# EAGLE design test (EAGLE 7.6.0)
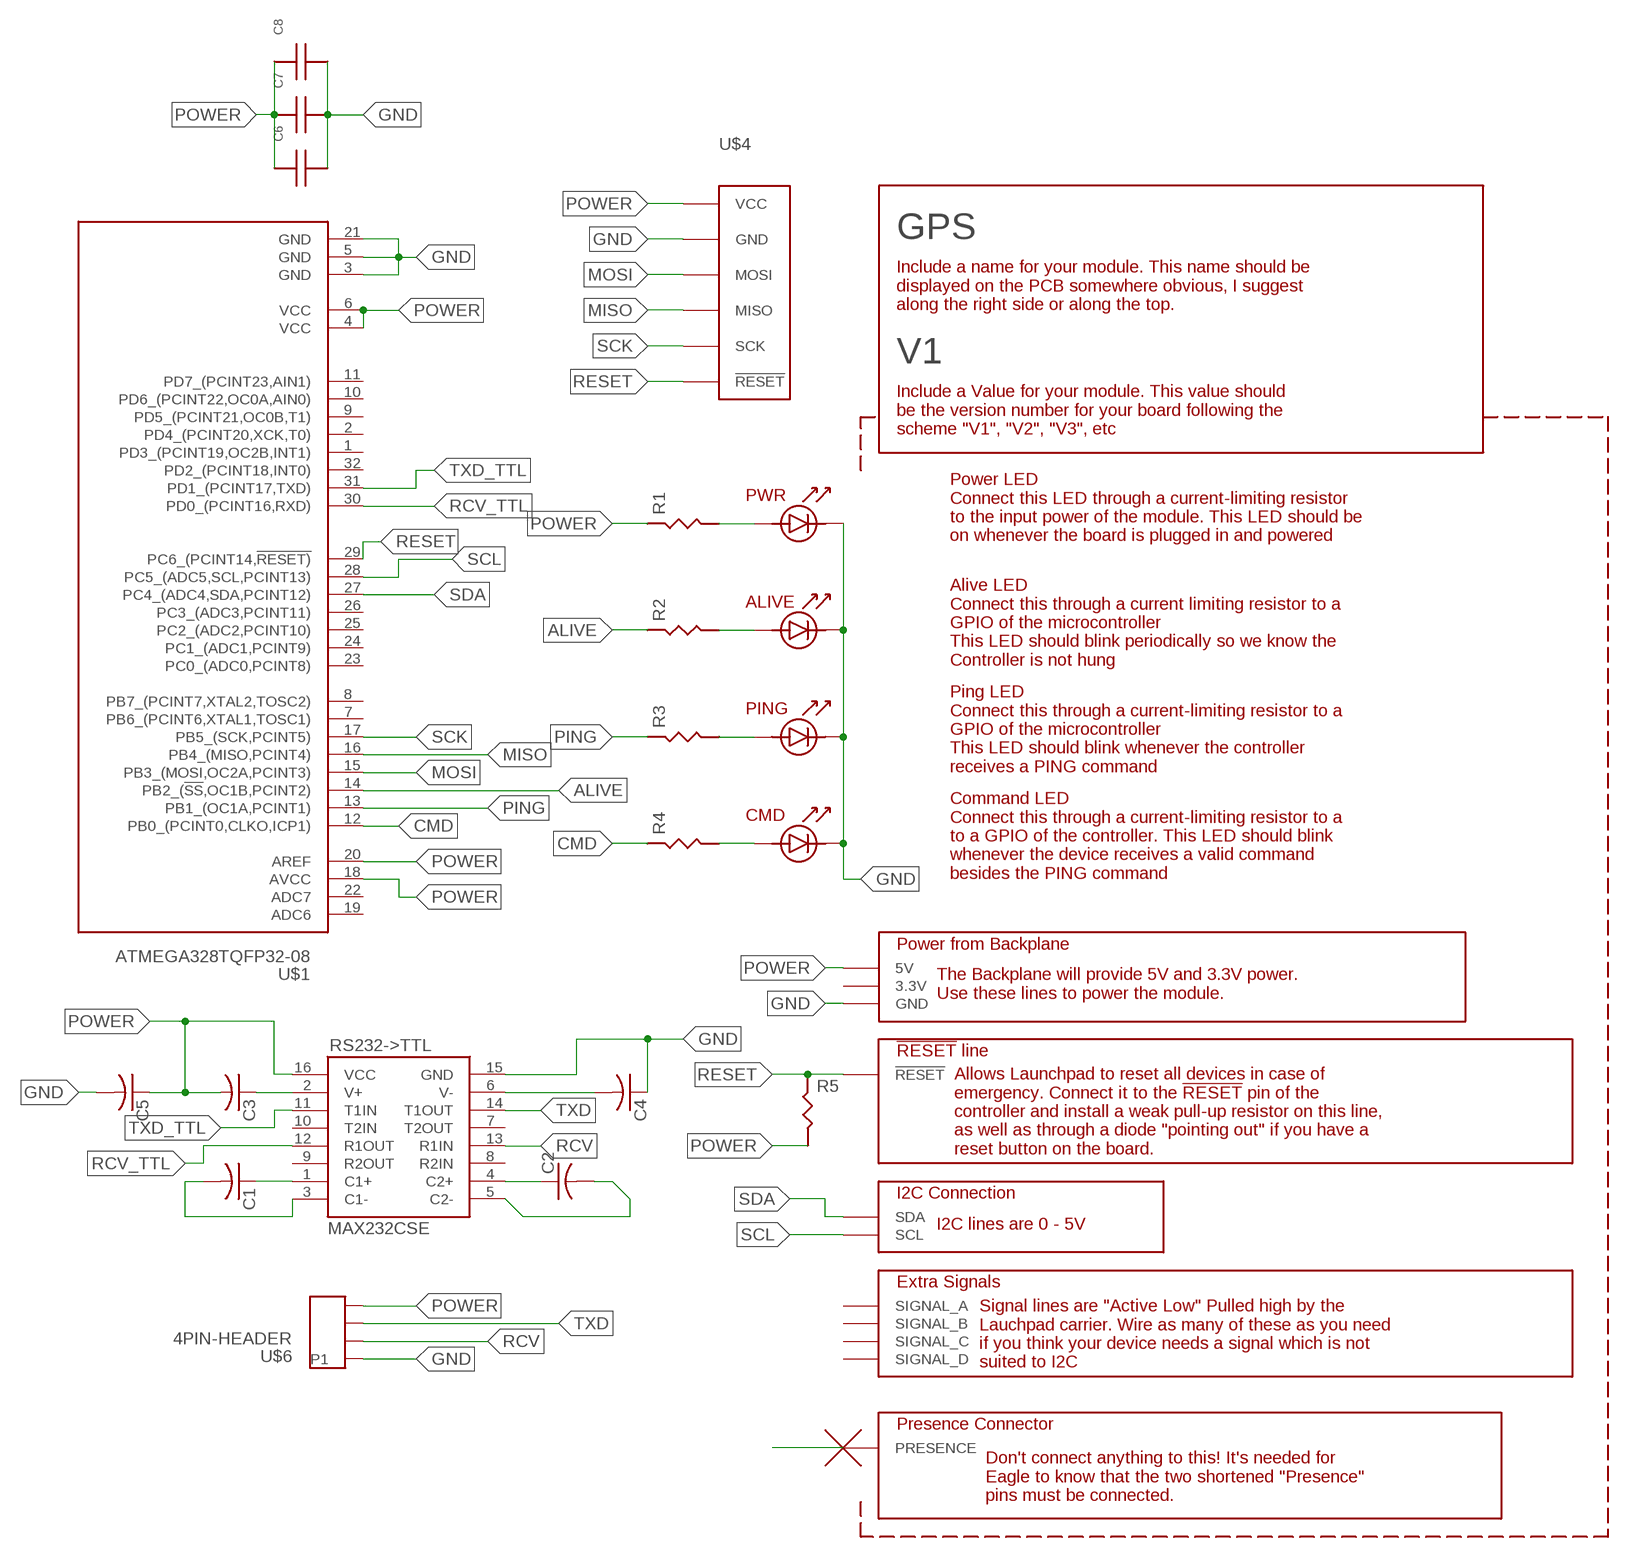
[diagram p0: schematic, sheet 1]

## Parts
C1  C-USC0805  [C0805]
C2  C-USC0805  [C0805]
C3  C-USC0805  [C0805]
C4  C-USC0805  [C0805]
C5  C-USC0805  [C0805]
C6  CAPACITOR-UNPOLARIZED0805  [0805_STACKPOLERESISTOR]
C7  CAPACITOR-UNPOLARIZED0805  [0805_STACKPOLERESISTOR]
C8  CAPACITOR-UNPOLARIZED0805  [0805_STACKPOLERESISTOR]
GPS  V1  EMBEDDED_SUBSYSTEM_V2SMALL  [SUBSYSTEM2016_V2-SMALL]
R1  RESISTOR  [0805_STACKPOLERESISTOR]
R2  RESISTOR  [0805_STACKPOLERESISTOR]
R3  RESISTOR  [0805_STACKPOLERESISTOR]
R4  RESISTOR  [0805_STACKPOLERESISTOR]
R5  RESISTOR  [0805_STACKPOLERESISTOR]
RS232->TTL  MAX232CSE  [MAX232CSE]
U$1  ATMEGA328TQFP32-08  [TQFP32-08]
U$4  ISP_PROGRAMMING_HEADER  [6PINHEADER_CORRECT]
U$6  4PIN-HEADER  [4HEADER_10MIL]

## Nets
ALIVE: R2.P$1 U$1.14(PB2_(!SS,OC1B,PCINT2))
CMD: R4.P$1 U$1.12(PB0_(PCINT0,CLKO,ICP1))
GND: C4.1 C5.2 C6.P$2 C7.P$2 C8.P$2 GPS.A7(GND) GPS.A8(GND) GPS.A9(GND) GPS.A10(GND) GPS.ALIVELED_CATHODE GPS.CMDLED_CATHODE GPS.PINGLED_CATHODE GPS.PWRLED_CATHODE RS232->TTL.15(GND) U$1.3(GND) U$1.5(GND) U$1.21(GND) U$4.6(GND) U$6.P$1(P1)
MISO: U$1.16(PB4_(MISO,PCINT4)) U$4.1(MISO)
MOSI: U$1.15(PB3_(MOSI,OC2A,PCINT3)) U$4.4(MOSI)
N$1: GPS.A2(PRESENCE) GPS.B17(PRESENCE)
N$2: C1.1 RS232->TTL.1(C1+)
N$3: C1.2 RS232->TTL.3(C1-)
N$4: C2.1 RS232->TTL.4(C2+)
N$5: C2.2 RS232->TTL.5(C2-)
N$6: C3.1 RS232->TTL.2(V+)
N$7: GPS.CMDLED_ANODE R4.P$2
N$8: GPS.PWRLED_ANODE R1.P$2
N$9: GPS.ALIVELED_ANODE R2.P$2
N$10: GPS.PINGLED_ANODE R3.P$2
PING: R3.P$1 U$1.13(PB1_(OC1A,PCINT1))
POWER: C3.2 C5.1 C6.P$1 C7.P$1 C8.P$1 GPS.B2(5V) GPS.B3(5V) R1.P$1 R5.P$2 RS232->TTL.16(VCC) U$1.4(VCC) U$1.6(VCC) U$1.18(AVCC) U$1.20(AREF) U$4.2(VCC) U$6.P$4
RCV: RS232->TTL.13(R1IN) U$6.P$2
RCV_TTL: RS232->TTL.12(R1OUT) U$1.30(PD0_(PCINT16,RXD))
RESET: GPS.B5(!RESET) GPS.B6(!RESET) R5.P$1 U$1.29(PC6_(PCINT14,!RESET)) U$4.5(!RESET)
SCK: U$1.17(PB5_(SCK,PCINT5)) U$4.3(SCK)
SCL: GPS.B9(SCL) GPS.B10(SCL) U$1.28(PC5_(ADC5,SCL,PCINT13))
SDA: GPS.B7(SDA) GPS.B8(SDA) U$1.27(PC4_(ADC4,SDA,PCINT12))
TXD: RS232->TTL.14(T1OUT) U$6.P$3
TXD_TTL: RS232->TTL.11(T1IN) U$1.31(PD1_(PCINT17,TXD))
V-: C4.2 RS232->TTL.6(V-)
Unconnected: GPS.A3(3.3V) GPS.A4(3.3V) GPS.A13(SIGNAL_C) GPS.A14(SIGNAL_C) GPS.A15(SIGNAL_D) GPS.A16(SIGNAL_D) GPS.B13(SIGNAL_A) GPS.B14(SIGNAL_A) GPS.B15(SIGNAL_B) GPS.B16(SIGNAL_B) RS232->TTL.7(T2OUT) RS232->TTL.8(R2IN) RS232->TTL.9(R2OUT) RS232->TTL.10(T2IN) U$1.1(PD3_(PCINT19,OC2B,INT1)) U$1.2(PD4_(PCINT20,XCK,T0)) U$1.7(PB6_(PCINT6,XTAL1,TOSC1)) U$1.8(PB7_(PCINT7,XTAL2,TOSC2)) U$1.9(PD5_(PCINT21,OC0B,T1)) U$1.10(PD6_(PCINT22,OC0A,AIN0)) U$1.11(PD7_(PCINT23,AIN1)) U$1.19(ADC6) U$1.22(ADC7) U$1.23(PC0_(ADC0,PCINT8)) U$1.24(PC1_(ADC1,PCINT9)) U$1.25(PC2_(ADC2,PCINT10)) U$1.26(PC3_(ADC3,PCINT11)) U$1.32(PD2_(PCINT18,INT0))

## Library data of the parts
C1-C5 = rcl:C-US: CAPACITOR, American symbol
C6-C8 = 000_CustomPartsMaster:CAPACITOR-UNPOLARIZED
GPS = 000_CustomPartsMaster:EMBEDDED_SUBSYSTEM_V2
R1-R5 = 000_CustomPartsMaster:RESISTOR
RS232->TTL = MAX232CSE:MAX232CSE
U$1 = 000_CustomPartsMaster:ATMEGA328
U$4 = 000_CustomPartsMaster:ISP_PROGRAMMING_HEADER
U$6 = 000_CustomPartsMaster:4PIN-HEADER

## Board
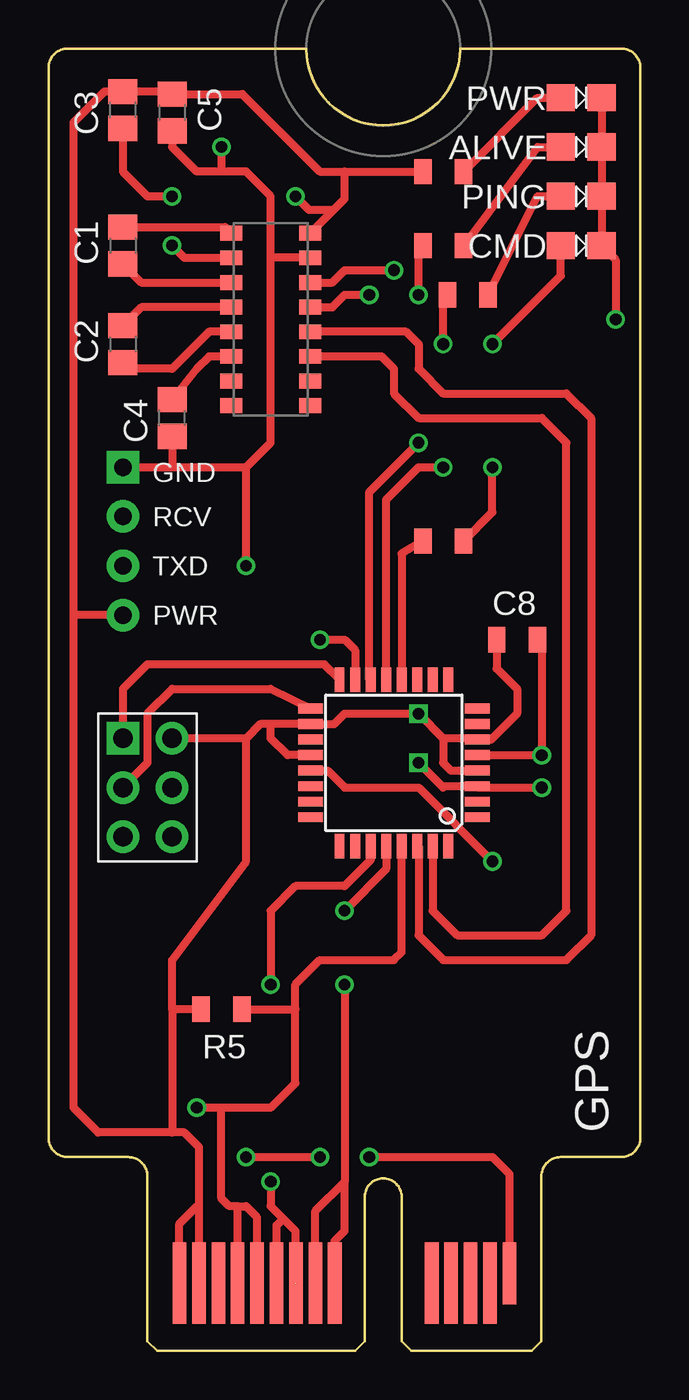
[diagram p1: board, top side]
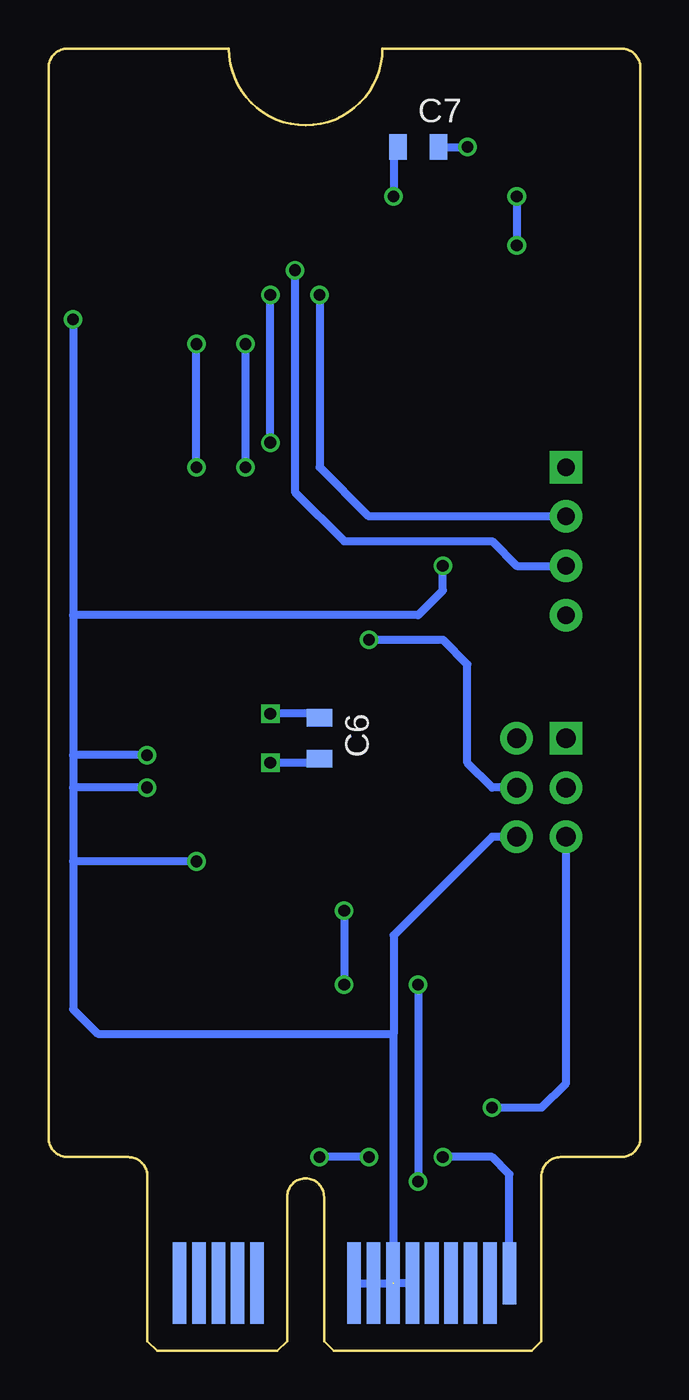
[diagram p2: board, bottom side, seen from below]

Size 30.5 x 67.15 mm. Coordinates in mm from the lower left corner, seen from the top.
Copper layers (1*16): Top 0.0356mm / dielectric 1.5011mm / Bottom 0.0356mm
Design rules "LaenPCBOrder": minimum track width 6mil, minimum drill 13mil, track to track 6mil, track to pad 6mil, pad to pad 6mil, via to via 6mil, smd to smd 6mil, copper to edge 15mil, drill to drill 6mil, minimum pad ring 7mil, minimum via ring 7mil, stop-mask expansion 3mil, vias tented up to drill 0mil, thermal gap 10mil

### Footprints (pad centres in the part's own frame; a part is rotated, then mirrored left to right if it is on the bottom)
C0805 = smd 1.3 x 1.5: 1 -0.95,0; 2 0.95,0
0805_STACKPOLERESISTOR = smd 0.9 x 1.3: P$1 -1.05,0; P$2 1.05,0
SUBSYSTEM2016_V2-SMALL = smd 0.7 x 3.2 bottom: A2 6.73,4.16 | smd 0.7 x 4.2 bottom: A3 7.73,3.66; A4 8.73,3.66; A5 9.73,3.66; A6 10.73,3.66; A7 11.73,3.66; A8 12.73,3.66; A9 13.73,3.66; A10 14.73,3.66; A13 19.73,3.66; A14 20.73,3.66; A15 21.73,3.66; A16 22.73,3.66; A17 23.73,3.66 | smd 1.45 x 1.4: ALIVELED_ANODE 26.382,62.23; ALIVELED_CATHODE 28.482,62.23; CMDLED_ANODE 26.382,57.15; CMDLED_CATHODE 28.482,57.15; PINGLED_ANODE 26.382,59.69; PINGLED_CATHODE 28.482,59.69; PWRLED_ANODE 26.382,64.77; PWRLED_CATHODE 28.482,64.77 | smd 0.7 x 4.2: B2 6.73,3.66; B3 7.73,3.66; B4 8.73,3.66; B5 9.73,3.66; B6 10.73,3.66; B7 11.73,3.66; B8 12.73,3.66; B9 13.73,3.66; B10 14.73,3.66; B13 19.73,3.66; B14 20.73,3.66; B15 21.73,3.66; B16 22.73,3.66 | smd 0.7 x 3.2: B17 23.73,4.16
MAX232CSE = smd 0.762 x 1.143: 1 -4.445,-2.032; 2 -3.175,-2.032; 3 -1.905,-2.032; 4 -0.635,-2.032; 5 0.635,-2.032; 6 1.905,-2.032; 7 3.175,-2.032; 8 4.445,-2.032; 9 4.445,2.032; 10 3.175,2.032; 11 1.905,2.032; 12 0.635,2.032; 13 -0.635,2.032; 14 -1.905,2.032; 15 -3.175,2.032; 16 -4.445,2.032
TQFP32-08 = smd 1.27 x 0.508: 1 -4.293,2.8; 2 -4.293,2; 3 -4.293,1.2; 4 -4.293,0.4; 5 -4.293,-0.4; 6 -4.293,-1.2; 7 -4.293,-2; 8 -4.293,-2.8; 17 4.293,-2.8; 18 4.293,-2; 19 4.293,-1.2; 20 4.293,-0.4; 21 4.293,0.4; 22 4.293,1.2; 23 4.293,2; 24 4.293,2.8 | smd 0.508 x 1.27: 9 -2.8,-4.293; 10 -2,-4.293; 11 -1.2,-4.293; 12 -0.4,-4.293; 13 0.4,-4.293; 14 1.2,-4.293; 15 2,-4.293; 16 2.8,-4.293; 25 2.8,4.293; 26 2,4.293; 27 1.2,4.293; 28 0.4,4.293; 29 -0.4,4.293; 30 -1.2,4.293; 31 -2,4.293; 32 -2.8,4.293
6PINHEADER_CORRECT = drill 1 pad 1.676 square: 1 0,0 | drill 1 pad 1.676: 2 2.54,0; 3 0,-2.54; 4 2.54,-2.54; 5 0,-5.08; 6 2.54,-5.08
4HEADER_10MIL = drill 0.9 pad 1.676 square: P$1 0,3.81 | drill 0.9 pad 1.676: P$2 0,1.27; P$3 0,-1.27; P$4 0,-3.81

### Placement (x,y rotation side)
C1  3.83,56.99 270 top
C2  3.83,51.91 270 top
C3  3.83,63.98 90 top
C4  6.37,48.1 90 top
C5  6.37,63.85 270 top
C6  16.53,31.59 270 bottom
C7  11.45,62.07 0 bottom
C8  24.15,36.67 0 top
GPS  0.02,-0.16 0 top
R1  20.34,60.8 0 top
R2  20.34,56.99 0 top
R3  21.61,54.45 0 top
R4  20.34,41.75 0 top
R5  8.91,17.62 180 top
RS232->TTL  11.45,53.18 270 top
U$1  17.8,30.32 180 top
U$4  3.83,31.59 0 top
U$6  3.83,41.75 0 top

### Tracks (layer width: path | path; a pad name or v marks a point on that pad's centre or on a via)
ALIVE  (via drill 0.6)
  Top 0.406: U$1.14 16.53,34.61 16.53,44.29 v19.07,46.83 | v19.07,54.45 19.07,56.99 R2.P$1
  Bottom 0.406: v19.07,46.83 v19.07,54.45
CMD
  Top 0.406: R4.P$1 18.2,41.1 U$1.12
GND  (via drill 0.6)  (1 unrouted)
  Top 0.406: U$1.5 v25.42,30.72 25.42,36.45 C8.P$2 | GPS.PWRLED_CATHODE GPS.ALIVELED_CATHODE GPS.PINGLED_CATHODE GPS.CMDLED_CATHODE 29.23,56.26 v29.23,53.18 | v25.42,29.05 22.16,29.05 U$1.3 20.41,29.12 20.34,29.05 v19.07,30.32 | C5.2 6.37,62.07 7.64,60.8 8.91,60.8 | U$6.P$1 6.37,45.56 | 6.37,45.56 10.18,45.56 | 10.18,45.56 11.45,46.83 11.45,56.36 | 11.45,56.36 11.45,59.53 10.18,60.8 8.91,60.8 | RS232->TTL.15 11.45,56.36 | v10.18,40.48 10.18,45.56 | C4.1 6.37,45.56 | U$1.21 14.39,29.92 15.26,29.05 19.07,29.05 v22.88,25.24 | v8.91,62.07 8.91,60.8
  Bottom 0.406: GPS.A7 12.72,3.5 12.72,16.35 | v29.23,53.18 29.23,37.94 | 29.23,37.94 29.23,30.72 | 29.23,30.72 29.23,29.05 | 29.23,29.05 29.23,25.24 | 29.23,25.24 29.23,17.62 27.96,16.35 12.72,16.35 | v25.42,30.72 29.23,30.72 | v25.42,29.05 29.23,29.05 | 29.23,37.94 11.45,37.94 10.18,39.21 v10.18,40.48 | U$4.6 7.64,26.51 12.72,21.43 12.72,16.35 | v22.88,25.24 29.23,25.24 | C6.P$2 16.75,30.32 v19.07,30.32 | C7.P$2 v8.91,62.07 | GPS.A10 GPS.A9 GPS.A8
MISO
  Top 0.406: U$1.16 14.21,35.4 5.1,35.4 3.83,34.13 U$4.1
MOSI  (via drill 0.6)
  Top 0.406: v13.99,36.67 15.26,36.67 15.8,36.13 U$1.15
  Bottom 0.406: v13.99,36.67 10.18,36.67 8.91,35.4 8.91,30.32 7.64,29.05 U$4.4
N$1  (via drill 0.6)
  Top 0.406: v10.18,10 v13.99,10 | v16.53,10 22.88,10 23.75,9.13 GPS.B17
  Bottom 0.406: GPS.A2 6.75,9.11 7.64,10 v10.18,10 | v13.99,10 v16.53,10
N$2
  Top 0.406: C1.1 9.1,57.94 RS232->TTL.1
N$3
  Top 0.406: C1.2 4.78,55.09 RS232->TTL.3
N$4
  Top 0.406: RS232->TTL.4 4.78,53.82 C2.1
N$5
  Top 0.406: RS232->TTL.5 8.28,52.55 6.37,50.64 4.15,50.64 C2.2
N$6  (via drill 0.6)
  Top 0.406: v6.37,56.99 7,56.36 RS232->TTL.2 | C3.1 3.83,60.8 5.1,59.53 v6.37,59.53
  Bottom 0.406: v6.37,59.53 v6.37,56.99
N$7  (via drill 0.6)
  Top 0.406: R4.P$2 22.88,43.24 v22.88,45.56 | v22.88,51.91 26.4,55.43 GPS.CMDLED_ANODE
  Bottom 0.406: v22.88,45.56 v22.88,51.91
N$8
  Top 0.406: R1.P$2 25.2,64.61 GPS.PWRLED_ANODE
N$9
  Top 0.406: R2.P$2 25.2,62.07 GPS.ALIVELED_ANODE
N$10
  Top 0.406: R3.P$2 25.2,59.53 GPS.PINGLED_ANODE
PING  (via drill 0.6)
  Top 0.406: v20.34,51.91 20.34,54.45 R3.P$1 | U$1.13 17.4,43.89 19.07,45.56 v20.34,45.56
  Bottom 0.406: v20.34,45.56 v20.34,51.91
POWER  (via drill 0.6)
  Top 0.406: R5.P$2 6.37,17.62 | 6.37,17.62 6.37,20.16 10.18,25.24 10.18,31.59 | 10.18,31.59 U$4.2 | 15.26,60.8 13.99,60.8 9.99,64.8 C5.1 6.24,64.92 C3.2 2.88,64.92 1.29,63.34 1.29,37.94 | 15.26,60.8 R1.P$1 | 7.75,7.46 7.75,10.53 7,11.27 6.37,11.27 | 7.75,7.46 GPS.B3 | 11.45,32.32 U$1.18 14.72,32.32 15.26,32.86 v19.07,32.86 20.34,31.59 | 11.45,32.32 10.91,32.32 10.18,31.59 | U$1.20 12.32,30.72 11.45,31.59 11.45,32.32 | 6.37,11.27 2.56,11.27 1.29,12.54 1.29,37.94 | RS232->TTL.16 14.69,58.83 | 14.69,58.83 15.26,59.4 15.26,60.8 | 6.37,17.62 6.37,11.27 | U$6.P$4 1.29,37.94 | 20.34,31.59 20.34,30.32 20.74,29.92 U$1.4 | C8.P$1 23.1,35.18 24.15,34.13 24.15,32.86 22.81,31.52 U$1.6 22.02,31.59 20.34,31.59 | v12.72,59.53 13.42,58.83 14.69,58.83 | GPS.B2 6.75,6.57 7.64,7.46 7.75,7.46
  Bottom 0.406: C6.P$1 16.75,32.86 v19.07,32.86 | C7.P$1 12.72,61.85 v12.72,59.53
RCV  (via drill 0.6)
  Top 0.406: RS232->TTL.13 14.62,53.82 15.26,54.45 v16.53,54.45
  Bottom 0.406: U$6.P$2 13.99,43.02 16.53,45.56 v16.53,54.45
RCV_TTL
  Top 0.406: U$1.30 19.07,26.03 19.07,21.43 20.34,20.16 26.69,20.16 27.96,21.43 27.96,48.1 26.69,49.37 20.34,49.37 19.07,50.64 19.07,51.91 18.43,52.55 RS232->TTL.12
RESET  (via drill 0.6)
  Top 0.406: R5.P$1 12.72,17.62 | U$1.29 18.2,20.56 17.8,20.16 13.99,20.16 12.72,18.89 12.72,17.62 | 8.91,12.54 11.45,12.54 12.72,13.81 12.72,17.62 | 8.91,12.54 v7.64,12.54 | GPS.B6 10.75,6.89 10.18,7.46 9.75,7.46 | 8.91,12.54 8.91,7.87 9.32,7.46 9.75,7.46 | GPS.B5 9.75,7.46
  Bottom 0.406: v7.64,12.54 5.1,12.54 3.83,13.81 U$4.5
SCK
  Top 0.406: U$1.17 11.45,34.13 6.37,34.13 5.1,32.86 5.1,30.32 U$4.3
SCL  (via drill 0.6)
  Top 0.406: U$1.28 17.4,24.84 v15.26,22.7 | v15.26,18.89 15.26,8.73 | GPS.B9 13.75,7.22 15.26,8.73 | GPS.B10 14.75,5.68 15.26,6.19 15.26,8.73
  Bottom 0.406: v15.26,22.7 v15.26,18.89
SDA  (via drill 0.6)
  Top 0.406: U$1.27 16.6,25.31 15.26,23.97 12.72,23.97 11.45,22.7 v11.45,18.89 | v11.45,8.73 11.45,7.46 12.08,6.83 | 12.08,6.83 12.72,6.19 12.72,3.53 GPS.B8 | GPS.B7 11.75,6.49 12.08,6.83
  Bottom 0.406: v11.45,18.89 v11.45,8.73
TXD  (via drill 0.6)
  Top 0.406: RS232->TTL.14 14.62,55.09 15.26,55.72 v17.8,55.72
  Bottom 0.406: v17.8,55.72 17.8,44.29 15.26,41.75 7.64,41.75 6.37,40.48 U$6.P$3
TXD_TTL
  Top 0.406: U$1.31 19.8,22.7 21.07,21.43 25.42,21.43 26.69,22.7 26.69,46.83 25.42,48.1 19.07,48.1 17.8,49.37 17.8,50.64 17.16,51.28 RS232->TTL.11
V-
  Top 0.406: RS232->TTL.6 8.28,51.28 7.64,50.64 C4.2

### Text on the board
tPlace: GND | RCV | TXD | PWR